# Altium schematic sheet CSAL.SchDoc
size A4; SheetNumber: 1; SheetTotal: 1
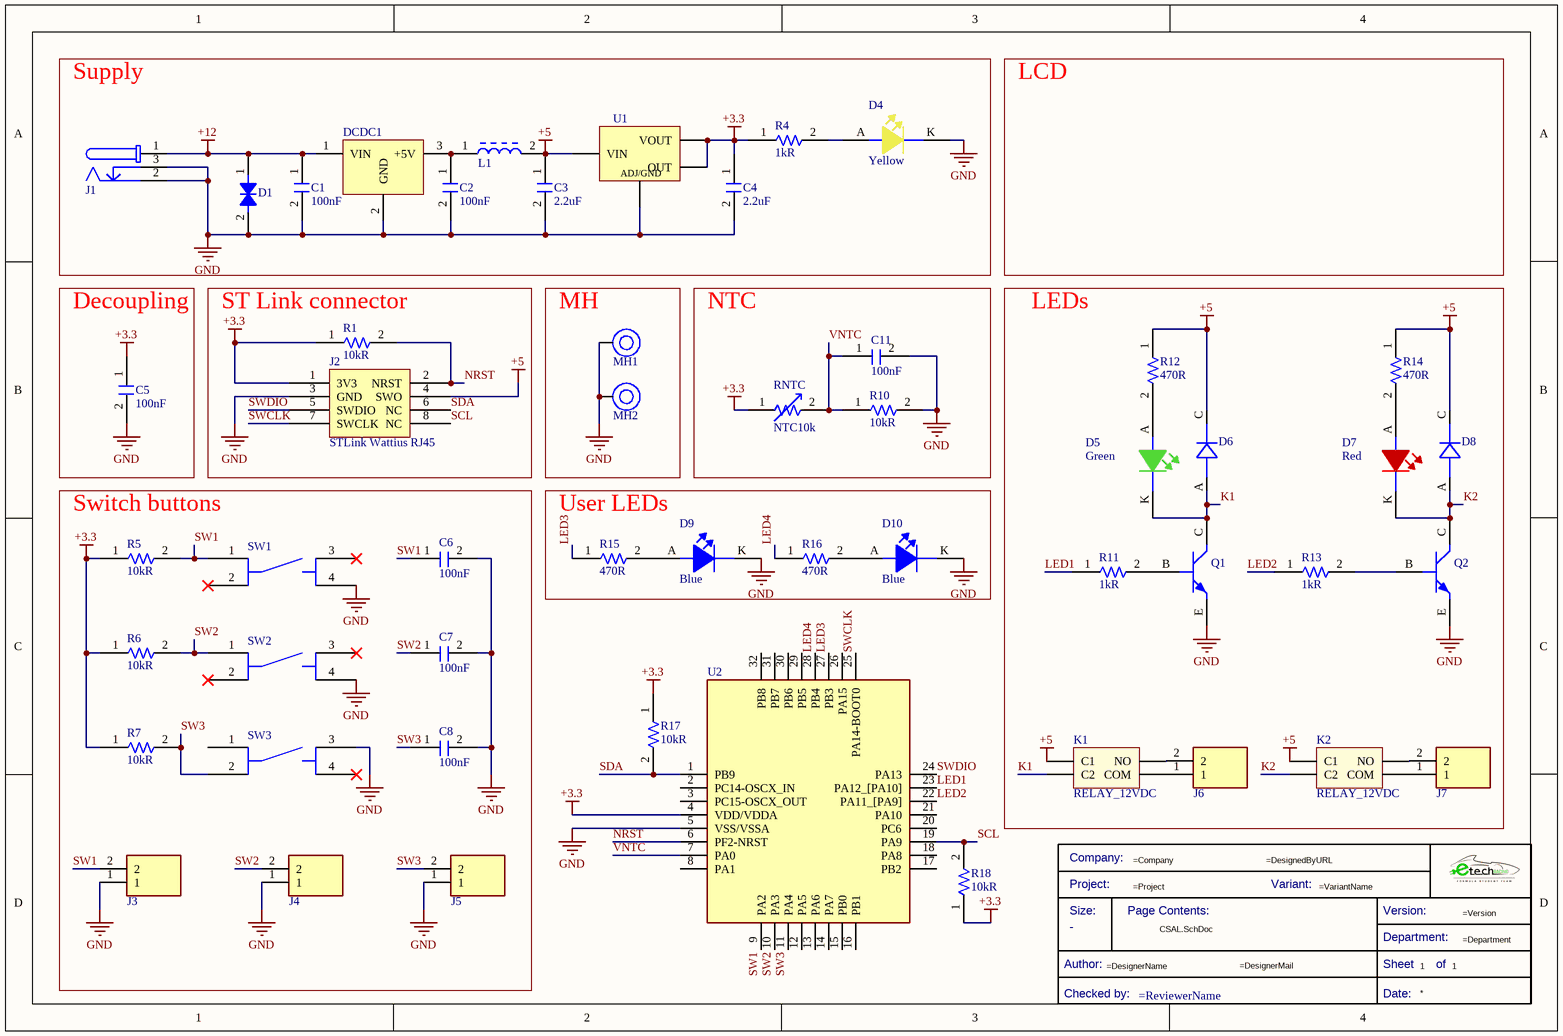
[diagram p0: CSAL.SchDoc]

## Parts
*  Title Block_template  (value not drawn)  (graphical)
C1  Capacitance: 100nF  [C0805FNPC-R]  (hidden comment: 885012207098)
C2  Capacitance: 100nF  [C0805FNPC-R]  (hidden comment: 885012207098)
C3  2.2uF  [C0805FNPC-W]
C4  2.2uF  [C0805FNPC-W]
C5  Capacitance: 100nF  [C0805FNPC-R]  (hidden comment: 885012207098)
C6  Capacitance: 100nF  [C0805FNPC-R]  (hidden comment: 885012207098)
C7  Capacitance: 100nF  [C0805FNPC-R]  (hidden comment: 885012207098)
C8  Capacitance: 100nF  [C0805FNPC-R]  (hidden comment: 885012207098)
C11  Capacitance: 100nF  [C0805FNPC-R]  (hidden comment: 885012207098)
D1  824501261  [DTVS-DO-214AC]  (value not drawn)
D4  Color: Yellow  [LED_1206_WE]  (hidden comment: 150120YS75000)
D5  Color: Green  [LED_1206_WE]  (hidden comment: 150120GS75000)
D6  D_THT_1N4004  [D_THT]  (value not drawn)
D7  Color: Red  [LED_1206_WE]  (hidden comment: 150120RS75000)
D8  D_THT_1N4004  [D_THT]  (value not drawn)
D9  Color: Blue  [LED_1206_WE]  (hidden comment: 150120BS75000)
D10  Color: Blue  [LED_1206_WE]  (hidden comment: 150120BS75000)
DCDC1  173010542  [DCDC_Magi3c]  (value not drawn)
J1  694108301002  [694108301002]  (value not drawn)
J2  STLink Wattius RJ45  [STLINK_RJ45]
J3  J_2_CableContact  [TE_282834-2]  (value not drawn)
J4  J_2_CableContact  [TE_282834-2]  (value not drawn)
J5  J_2_CableContact  [TE_282834-2]  (value not drawn)
J6  J_2_CableContact  [TE_282834-2]  (value not drawn)
J7  J_2_CableContact  [TE_282834-2]  (value not drawn)
K1  RELAY_12VDC  [RELAY_ALQ305]
K2  RELAY_12VDC  [RELAY_ALQ305]
L1  BLM18EG331TN1D  [L_Ferrite_Bead_0805]  (value not drawn)
MH1  Mounting_Hole_M3  [Mounting_Hole_M3]  (value not drawn)
MH2  Mounting_Hole_M3  [Mounting_Hole_M3]  (value not drawn)
Q1  BC817-25LT1G  [TRT-NPN-0.5/45-SOT23]  (value not drawn)
Q2  BC817-25LT1G  [TRT-NPN-0.5/45-SOT23]  (value not drawn)
R1  Resistance: 10kR  [R0805FTK]  (hidden comment: CR0805-JW-103ELF)
R4  Resistance: 1kR  [R0805FTK]  (hidden comment: CR0805-JW-102ELF)
R5  Resistance: 10kR  [R0805FTK]  (hidden comment: CR0805-JW-103ELF)
R6  Resistance: 10kR  [R0805FTK]  (hidden comment: CR0805-JW-103ELF)
R7  Resistance: 10kR  [R0805FTK]  (hidden comment: CR0805-JW-103ELF)
R10  Resistance: 10kR  [R0805FTK]  (hidden comment: CR0805-JW-103ELF)
R11  Resistance: 1kR  [R0805FTK]  (hidden comment: CR0805-JW-102ELF)
R12  Resistance: 470R  [R0805FTK]  (hidden comment: CR0805-FX-4700GLF)
R13  Resistance: 1kR  [R0805FTK]  (hidden comment: CR0805-JW-102ELF)
R14  Resistance: 470R  [R0805FTK]  (hidden comment: CR0805-FX-4700GLF)
R15  Resistance: 470R  [R0805FTK]  (hidden comment: CR0805-FX-4700GLF)
R16  Resistance: 470R  [R0805FTK]  (hidden comment: CR0805-FX-4700GLF)
R17  Resistance: 10kR  [R0805FTK]  (hidden comment: CR0805-JW-103ELF)
R18  Resistance: 10kR  [R0805FTK]  (hidden comment: CR0805-JW-103ELF)
RNTC  NTC10k  [NTC10k_0805]
SW1  Tactile SW  [SW_2-1437565-7]  (value not drawn)
SW2  Tactile SW  [SW_2-1437565-7]  (value not drawn)
SW3  Tactile SW  [SW_2-1437565-7]  (value not drawn)
U1  LM1117IMP-3.3/NOPB  [LDO_10V-0.8/3V3-SOT223]  (value not drawn)
U2  STM32C031K4T6  [QFP80P900X900X160-32N]  (value not drawn)

## Blocks framed on the sheet
Supply: C1-C4 D1 D4 DCDC1 J1 L1 R4 U1
Decoupling: C5
ST Link connector: J2 R1
MH: MH1 MH2
NTC: C11 R10 RNTC
LEDs: D5-D8 J6 J7 K1 K2 Q1 Q2 R11-R14
Switch buttons: C6-C8 J3-J5 R5-R7 SW1-SW3
User LEDs: D9 D10 R15 R16

## Nets
+3.3: C4.1 C5.1 J2.1(3V3) R1.1 R4.1 R5.1 R6.1 R7.1 R17.1 R18.1 RNTC.1 U1.2(OUT) U1.4(VOUT) U2.4(VDD/VDDA)
+5: C3.1 D6.C D8.C J2.4(SWO) K1.C1 K2.C1 L1.2 R12.1 R14.1 U1.3(VIN)
+12: C1.1 D1.1 DCDC1.1(VIN) J1.1
GND: C1.2 C2.2 C3.2 C4.2 C5.2 C6.2 C7.2 C8.2 C11.2 D1.2 D4.K D9.K D10.K DCDC1.2(GND) J1.2 J1.3 J2.3(GND) J3.1 J4.1 J5.1 MH1.1 MH2.1 Q1.E Q2.E R10.2 SW1.4 SW2.4 SW3.3 U1.1(ADJ/GND) U2.5(VSS/VSSA)
K1: D5.K D6.A K1.C2 Q1.C
K2: D7.K D8.A K2.C2 Q2.C
LED1: R11.1 U2.23(PA12_[PA10])
LED2: R13.1 U2.22(PA11_[PA9])
LED3: R15.1 U2.27(PB3)
LED4: R16.1 U2.28(PB4)
NRST: J2.2(NRST) R1.2 U2.6(PF2-NRST)
SCL: J2.8(NC) R18.2 U2.19(PA9)
SDA: J2.6(NC) R17.2 U2.1(PB9)
SW1: C6.1 J3.2 R5.2 SW1.1
SW2: C7.1 J4.2 R6.2 SW2.1
SW3: C8.1 J5.2 R7.2 SW3.2
SWCLK: J2.7(SWCLK) U2.25(PA14-BOOT0)
SWDIO: J2.5(SWDIO) U2.24(PA13)
VNTC: C11.1 R10.1 RNTC.2 U2.7(PA0)
NetC2_1: C2.1 DCDC1.3(+5V) L1.1
NetD4_A: D4.A R4.2
NetD5_A: D5.A R12.2
NetD7_A: D7.A R14.2
NetD9_A: D9.A R15.2
NetD10_A: D10.A R16.2
NetJ6_1: J6.1 K1.COM
NetJ6_2: J6.2 K1.NO
NetJ7_1: J7.1 K2.COM
NetJ7_2: J7.2 K2.NO
NetQ1_B: Q1.B R11.2
NetQ2_B: Q2.B R13.2

Not connected (* = marked no-connect by the designer): SW1 2* 3*; SW2 2* 3*; SW3 1 4*; U2 2(PC14-OSCX_IN) 3(PC15-OSCX_OUT) 8(PA1) 9(PA2) 10(PA3) 11(PA4) 12(PA5) 13(PA6) 14(PA7) 15(PB0) 16(PB1) 17(PB2) 18(PA8) 20(PC6) 21(PA10) 26(PA15) 29(PB5) 30(PB6) 31(PB7) 32(PB8)

## Notes on the sheet
- LCD
- Labels drawn without touching a wire or pin: SW1, SW2, SW3
- (in symbol Title Block_template) Company:; Project:; Variant:; Size:; Page Contents:; Version:; Department:; Author:; Sheet; of; Checked by:; Date:

## Library data of the parts
* = Title Block_template: Standard Title Block; .Creator: GP; Category: Title Block; .PCBcheck: GP; .SCHcheck: GP; Checked by:: =ReviewerName; Size: -
C1 C2 C5-C8 C11 = C100n-50V-0805FNPC-X7R: Cap, 0.1ΜF, 50V, 10%, X7R, 0805; Manufacturer 1: Wurth Electronics; .Creator: DR; Supplier 1: RSComponents; Manufacturer Part Number 1: 885012207098; RoHS: Yes; Category: Ceramic Capacitors; Stock 1: 8000; Pricing 1: 100=0,10200, 500=0,07100, 2000=0,06100 (GBP); Mount: Surface Mount; Case/Package: 0805; Case Code (Metric): 2012; Case Code (Imperial): 0805; Min Operating Temperature: -55°C; Max Operating Temperature: 125°C; Packaging: Cut Tape; Voltage Rating: 50V; Dielectric: X7R; Tolerance: 10%; Voltage Rating (DC): 50V; Length: 0.079inch; Width: 0.049inch; Thickness: 0.035inch; REACH SVHC: Unknown; RoHS Compliant: Yes; ComponentLink1URL: http://www.farnell.com/datasheets/1958498.pdf?src-supplier=Farnell; ComponentLink1Description: http://www.farnell.com/datasheets/1958498.pdf?src-supplier=Farnell; ComponentLink2URL: http://www.farnell.com/datasheets/1958498.pdf?src-supplier=Element14; ComponentLink2Description: http://www.farnell.com/datasheets/1958498.pdf?src-supplier=Element14; ComponentLink3URL: https://katalog.we-online.de/pbs/datasheet/885012207098.pdf?src-supplier=Digi-Key; ComponentLink3Description: https://katalog.we-online.de/pbs/datasheet/885012207098.pdf?src-supplier=Digi-Key; ComponentLink4URL: http://www.farnell.com/datasheets/1958498.pdf?src-supplier=Newark; ComponentLink4Description: http://www.farnell.com/datasheets/1958498.pdf?src-supplier=Newark; Supplier Part Number 1: 1813493
C3 C4 = C2.2u-16V-0805FTK
D1 = DTVS-26V-DO-214AC: TVS diode [Würth Elektronik] 824501261 TVS diode; Manufacturer: Wurth Electronics; Number of Bidirectional Channels: 1; Reverse Standoff Voltage: 26V; Min Breakdown Voltage: 30.4V; Clamping Voltage: 42.1V; Peak Pulse Power: 400W; Power Line Protection: No; Polarity: Bidirectional; Peak Pulse Current: 9.5A; .Creator: DO; Supplier 1: RSComponents; Manufacturer Part Number: 824501261; RoHS: Yes; Category: TVS Diodes; Stock 1: 1; Pricing 1: 50=0,29400, 250=0,26100, 500=0,21200, 1000=0,20100, 2000=0,19600 (USD); Mount: Surface Mount; Number of Pins: 2; Min Operating Temperature: -65°C; Max Operating Temperature: 150°C; Packaging: Cut Tape; Max Breakdown Voltage: 30.4V; Resistor Type: Zener; REACH SVHC: Unknown; RoHS Compliant: Yes; ComponentLink1URL: http://www.farnell.com/datasheets/2036389.pdf?src-supplier=Farnell; ComponentLink1Description: http://www.farnell.com/datasheets/2036389.pdf?src-supplier=Farnell; ComponentLink2URL: http://www.farnell.com/datasheets/2036389.pdf?src-supplier=Element14; ComponentLink2Description: http://www.farnell.com/datasheets/2036389.pdf?src-supplier=Element14; ComponentLink3URL: https://katalog.we-online.de/pbs/datasheet/824501261.pdf?src-supplier=Digi-Key; ComponentLink3Description: https://katalog.we-online.de/pbs/datasheet/824501261.pdf?src-supplier=Digi-Key; Supplier Part Number 1: 9217305; ComponentLink4Description: Where buy it; ComponentLink4URL: https://www.we-online.com/catalog/en/WE-TVSP?sq=824501261#824501261
D4 = LEDYS-1206-120: Led, Yellow, 590 Nm, 2 V, 30 Ma, 120 Mcd Rohs Compliant: Yes; Manufacturer: Wurth Electronics; Wavelength: 590nm; Luminous Intensity: 120mcd; Forward Current: 30mA; Viewing Angle: 140°; Lens Style: Clear,Rectangular; Test Current: 20mA; Forward Voltage: 2V; .Creator: GP; Supplier 1: Newark; Manufacturer Part Number: 150120YS75000; RoHS: Yes; Category: LEDs; Stock 1: 7333; Pricing 1: 1=0,22700, 5=0,22700, 10=0,22100, 25=0,21300, 50=0,20700, 100=0,18200, 500=0,16200 (USD); Mount: Surface Mount; Case/Package: 1206; Case Code (Metric): 3216; Case Code (Imperial): 1206; Min Operating Temperature: -40°C; Max Operating Temperature: 85°C; Package Quantity: 3000; Packaging: Tape and Reel; Dominant Wavelength: 590nm; Length: 3.2mm; Width: 1.6mm; Height: 0.68mm; REACH SVHC: Unknown; RoHS Compliant: Yes; ComponentLink1URL: https://datasheet.ciiva.com/29561/150120ys75000-29561868.pdf?src-supplier=Digi-Key; ComponentLink1Description: https://datasheet.ciiva.com/29561/150120ys75000-29561868.pdf?src-supplier=Digi-Key; ComponentLink2URL: https://datasheet.ciiva.com/29279/759445-da-01-en-chipled-1206-w-kl-gelb-150120ys75000-29279074.pdf?src-supplier=Conrad; ComponentLink2Description: https://datasheet.ciiva.com/29279/759445-da-01-en-chipled-1206-w-kl-gelb-150120ys75000-29279074.pdf?src-supplier=Conrad; Supplier Part Number 1: 95W3811; ComponentLink3Description: Where buy it; ComponentLink3URL: https://www.we-online.com/catalog/en/WL-SMCW?sq=150120YS75000#150120YS75000
D5 = LEDGS-1206-450: Led, Green, 520 Nm, 3.2 V, 30 Ma, 450 Mcd Rohs Compliant: Yes; Manufacturer: Wurth Electronics; Wavelength: 520nm; Luminous Intensity: 450mcd; Viewing Angle: 140°; Forward Current: 30mA; Lens Style: Clear,Rectangular; Test Current: 20mA; Forward Voltage: 3.2V; .Creator: GP; Supplier 1: RSComponents; RoHS: Yes; Category: LEDs; Stock 1: 1; Pricing 1: 50=0,23200, 500=0,16400, 750=0,15500, 1500=0,15000, 3000=0,14200 (USD); Mount: Surface Mount; Case/Package: 1206; Case Code (Metric): 3216; Case Code (Imperial): 1206; Min Operating Temperature: -40°C; Max Operating Temperature: 85°C; Package Quantity: 3000; Packaging: Tape and Reel; Dominant Wavelength: 520nm; Length: 3.2mm; Width: 1.6mm; Height: 0.68mm; REACH SVHC: Unknown; RoHS Compliant: Yes; ComponentLink1URL: https://datasheet.ciiva.com/22656/150120gs75000-22656979.pdf?src-supplier=Element14; ComponentLink1Description: https://datasheet.ciiva.com/22656/150120gs75000-22656979.pdf?src-supplier=Element14; ComponentLink2URL: https://datasheet.ciiva.com/29279/759441-da-01-en-chipled-1206-w-kl-gruen-150120gs75000-29279042.pdf?src-supplier=Conrad; ComponentLink2Description: https://datasheet.ciiva.com/29279/759441-da-01-en-chipled-1206-w-kl-gruen-150120gs75000-29279042.pdf?src-supplier=Conrad; ComponentLink3URL: https://datasheet.ciiva.com/48430/150120gs75000-eng-tds-48430053.pdf?src-supplier=Distrelec; ComponentLink3Description: https://datasheet.ciiva.com/48430/150120gs75000-eng-tds-48430053.pdf?src-supplier=Distrelec; ComponentLink4URL: https://datasheet.ciiva.com/29561/150120gs75000-29561883.pdf?src-supplier=Digi-Key; ComponentLink4Description: https://datasheet.ciiva.com/29561/150120gs75000-29561883.pdf?src-supplier=Digi-Key; ComponentLink5URL: https://datasheet.ciiva.com/29561/150120gs75000-29561884.pdf?src-supplier=Digi-Key; ComponentLink5Description: https://datasheet.ciiva.com/29561/150120gs75000-29561884.pdf?src-supplier=Digi-Key; ComponentLink6URL: https://datasheet.ciiva.com/29561/150120gs75000-29561885.pdf?src-supplier=Digi-Key; ComponentLink6Description: https://datasheet.ciiva.com/29561/150120gs75000-29561885.pdf?src-supplier=Digi-Key; Supplier Part Number 1: 8154247P; Manufacturer Part Number: 150120GS75000; ComponentLink7Description: Where buy it; ComponentLink7URL: https://www.we-online.com/catalog/en/WL-SMCW?sq=150120GS75000#150120GS75000
D6 D8 = D_THT_1N4004: Diode Standard 400V 1A Through Hole DO-41; MP: 1N4004; MF: ON Semiconductor; Value: *; SnapEDA_Link: https://www.snapeda.com/parts/1N4004/ON%20Semiconductor/view-part/2776954/?ref=snap; Check_prices: https://www.snapeda.com/parts/1N4004/ON%20Semiconductor/view-part/2776954/?ref=eda; Availability: Good; Price: None; Package: DO-41 Diodes Inc.
D7 = LEDRS-1206-150: Led, Red, 625 Nm, 2 V, 30 Ma, 150 Mcd Rohs Compliant: Yes; Manufacturer: Wurth Electronics; Viewing Angle: 140°; Lens Style: Clear,Rectangular; Luminous Intensity: 150mcd; Wavelength: 625nm; Forward Current: 30mA; Test Current: 20mA; Forward Voltage: 2V; .Creator: GP; Supplier 1: RSComponents; Manufacturer Part Number: 150120RS75000; RoHS: Yes; Category: LEDs; Stock 1: 1; Pricing 1: 50=0,23200, 500=0,16400, 750=0,15500, 1500=0,15000, 3000=0,14200 (USD); Mount: Surface Mount; Case/Package: 1206; Case Code (Metric): 3216; Case Code (Imperial): 1206; Min Operating Temperature: -40°C; Max Operating Temperature: 85°C; Package Quantity: 1; Packaging: Tape and Reel; Dominant Wavelength: 625nm; Length: 3.2mm; Width: 1.6mm; Height: 0.68mm; REACH SVHC: Unknown; RoHS Compliant: Yes; ComponentLink1URL: https://datasheet.ciiva.com/29561/150120rs75000-29561888.pdf?src-supplier=Digi-Key; ComponentLink1Description: https://datasheet.ciiva.com/29561/150120rs75000-29561888.pdf?src-supplier=Digi-Key; ComponentLink2URL: https://datasheet.ciiva.com/29279/759442-da-01-en-chipled-1206-w-kl-rot-150120rs75000-29279067.pdf?src-supplier=Conrad; ComponentLink2Description: https://datasheet.ciiva.com/29279/759442-da-01-en-chipled-1206-w-kl-rot-150120rs75000-29279067.pdf?src-supplier=Conrad; ComponentLink3URL: https://datasheet.ciiva.com/22656/1911465-22656982.pdf?src-supplier=Element14; ComponentLink3Description: https://datasheet.ciiva.com/22656/1911465-22656982.pdf?src-supplier=Element14; ComponentLink4URL: https://datasheet.ciiva.com/48430/150120rs75000-eng-tds-48430054.pdf?src-supplier=Distrelec; ComponentLink4Description: https://datasheet.ciiva.com/48430/150120rs75000-eng-tds-48430054.pdf?src-supplier=Distrelec; Supplier Part Number 1: 8154256P; ComponentLink5Description: Where buy it; ComponentLink5URL: https://www.we-online.com/catalog/en/WL-SMCW#/articles/WL-SMCW-1206
D9 D10 = LEDBS-1206-145: Led, Blue, 470 Nm, 3.2 V, 30 Ma, 145 Mcd Rohs Compliant: Yes; Manufacturer: Wurth Electronics; Luminous Intensity: 145mcd; Viewing Angle: 140°; Wavelength: 470nm; Forward Current: 30mA; Lens Style: Clear,Rectangular; Test Current: 20mA; Forward Voltage: 3.2V; .Creator: GP; Supplier 1: RSComponents; Manufacturer Part Number: 150120BS75000; RoHS: Yes; Category: LEDs; Stock 1: 1; Pricing 1: 50=0,23200, 500=0,16400, 750=0,15500, 1500=0,15000, 3000=0,14200 (USD); Mount: Surface Mount; Case/Package: 1206; Case Code (Metric): 3216; Case Code (Imperial): 1206; Min Operating Temperature: -40°C; Max Operating Temperature: 85°C; Package Quantity: 3000; Packaging: Tape and Reel; Dominant Wavelength: 470nm; Length: 3.2mm; Width: 1.6mm; Height: 0.68mm; REACH SVHC: Unknown; RoHS Compliant: Yes; ComponentLink1URL: https://datasheet.ciiva.com/22656/150120bs75000-22656976.pdf?src-supplier=Element14; ComponentLink1Description: https://datasheet.ciiva.com/22656/150120bs75000-22656976.pdf?src-supplier=Element14; ComponentLink2URL: https://datasheet.ciiva.com/29279/759440-da-01-en-chipled-1206-w-kl-blau-150120bs75000-29279045.pdf?src-supplier=Conrad; ComponentLink2Description: https://datasheet.ciiva.com/29279/759440-da-01-en-chipled-1206-w-kl-blau-150120bs75000-29279045.pdf?src-supplier=Conrad; ComponentLink3URL: https://datasheet.ciiva.com/29561/150120bs75000-29561882.pdf?src-supplier=Digi-Key; ComponentLink3Description: https://datasheet.ciiva.com/29561/150120bs75000-29561882.pdf?src-supplier=Digi-Key; Supplier Part Number 1: 8154243; ComponentLink4Description: Where buy it; ComponentLink4URL: https://www.we-online.com/catalog/en/WL-SMCW?sq=150120BS75000#150120BS75000
DCDC1 = DCDC-42V/5V-1A: Würth Elektronik 8-42V to 5V 1A DC-DC; Manufacturer 1: Wurth Electronics; Number of Outputs: 1; Min Input Voltage: 8V; Max Input Voltage: 42V; Efficiency: 93%; .Creator: DR; Supplier 1: RSComponents; Manufacturer Part Number 1: 173010542; RoHS: Yes; Stock 1: 1; Pricing 1: 1=12,22500, 8=10,96900, 21=10,68900 (USD); Mount: Through Hole; Min Operating Temperature: -40°C; Max Operating Temperature: 85°C; Features: UVLO,OCP,OTP,SCP; Packaging: Rail/Tube; Voltage - Output 1: 5V; Max Output Current: 1A; RoHS Compliant: Yes; ComponentLink1URL: http://www.farnell.com/datasheets/2192895.pdf?src-supplier=Farnell; ComponentLink1Description: http://www.farnell.com/datasheets/2192895.pdf?src-supplier=Farnell; ComponentLink2URL: http://www.farnell.com/datasheets/2192895.pdf?src-supplier=Newark; ComponentLink2Description: http://www.farnell.com/datasheets/2192895.pdf?src-supplier=Newark; ComponentLink3URL: https://katalog.we-online.de/pm/datasheet/173010542.pdf?src-supplier=Digi-Key; ComponentLink3Description: https://katalog.we-online.de/pm/datasheet/173010542.pdf?src-supplier=Digi-Key; Supplier Part Number 1: 1447809
J1 = Supply_Jack_12V: WR-DC DC Power Jack Connector, Male, Right Angled, 24V, 5A; Manufacturer: Wurth Elektronik; Opening Diameter: 6.4mm; Plug Inner Diameter: 2.55mm; Plug Outer Diameter: 5.5mm; ComponentLink1Description: Website Link; ComponentLink1URL: https://www.we-online.com/redexpert/article/694108301002?ad; ComponentLink2Description: Datasheet Link; ComponentLink2URL: https://www.we-online.com/redexpert/spec/694108301002?ad; Manufacturer Part Number: 694108301002; Category: DC Power Jack Connector; Match Code: WR-DC; Mount: Through Hole; Operating Temperature Max: 85°C; Operating Temperature Min: -40°C; Packaging: Bag; Gender: Male; Orientation: Right Angled; Rated Current: 5A; Working Voltage: 24V
J2 = STLink_Wattius_RJ45_Adapter
J3-J7 = J_2_CableContact: MP: 282834-2; MF: {'manufacturer': u'TE Connectivity'}; Value: *; Availability: Unavailable; Package: None; Price: None
L1 = L_Ferrite_bead_BLM18EG331TN1D: Ferrite Beads Multi-Layer 330Ohm 25% 100MHz 500mA 210mOhm DCR 0603 Paper T/R; Manufacturer: Murata; Material: Ferrite,Steel; Impedance: 330R; DC Resistance (DCR): 210mR; Number of Lines: 1; .Creator: GP; Supplier 1: Digi-Key; Manufacturer Part Number: BLM18EG331TN1D; RoHS: Yes; Category: Ferrite Beads and Chips; Stock 1: 20037; Pricing 1: 1=0,23000, 10=0,17500, 25=0,14520, 50=0,12520, 100=0,11260, 250=0,09508, 500=0,08508, 1000=0,07257 (USD); Case/Package: 0603; Number of Pins: 2; Core Material: Ferrite; Case Code (Metric): 1608; Case Code (Imperial): 0603; Min Operating Temperature: -55°C; Max Operating Temperature: 125°C; Tolerance: 25%; Packaging: Tape and Reel; Current Rating: 500mA; Max DC Current: 500mA; Number of Circuits: 1; Package Quantity: 1; Max Current Rating: 500mA; Termination: SMD/SMT; Test Frequency: 100MHz; Series: BLM18E; Resistance: 210mR; Length: 1.6mm; Width: 0.8mm; Height: 0.8mm; Depth: 0.8mm; REACH SVHC: No SVHC; Lead Free: Lead Free; RoHS Compliant: Yes; ComponentLink1URL: https://datasheet.ciiva.com/1467/5169-1467232.pdf?src-supplier=Element14; ComponentLink1Description: https://datasheet.ciiva.com/1467/5169-1467232.pdf?src-supplier=Element14; ComponentLink2URL: https://datasheet.ciiva.com/11795/0900766b811b5866-11795405.pdf?src-supplier=RSComponents; ComponentLink2Description: https://datasheet.ciiva.com/11795/0900766b811b5866-11795405.pdf?src-supplier=RSComponents; ComponentLink3URL: https://datasheet.ciiva.com/41449/001172267-da-01-en-drossel-0603-330r-1-6x0-8mm-4000st-41449581.pdf?src-supplier=Conrad; ComponentLink3Description: https://datasheet.ciiva.com/41449/001172267-da-01-en-drossel-0603-330r-1-6x0-8mm-4000st-41449581.pdf?src-supplier=Conrad; ComponentLink4URL: https://datasheet.ciiva.com/1467/5169-1467233.pdf?src-supplier=Element14; ComponentLink4Description: https://datasheet.ciiva.com/1467/5169-1467233.pdf?src-supplier=Element14; ComponentLink5URL: https://datasheet.ciiva.com/1561/5169-1561345.pdf?src-supplier=Newark; ComponentLink5Description: https://datasheet.ciiva.com/1561/5169-1561345.pdf?src-supplier=Newark; ComponentLink6URL: https://datasheet.ciiva.com/3082/l0110s0101blm18e-3082714.pdf?src-supplier=Avnet; ComponentLink6Description: https://datasheet.ciiva.com/3082/l0110s0101blm18e-3082714.pdf?src-supplier=Avnet; ComponentLink7URL: https://datasheet.ciiva.com/6211/l0110s0101blm18e-6211470.pdf?src-supplier=Digi-Key; ComponentLink7Description: https://datasheet.ciiva.com/6211/l0110s0101blm18e-6211470.pdf?src-supplier=Digi-Key; ComponentLink8URL: https://datasheet.ciiva.com/6211/l0110s0101blm18e-6211471.pdf?src-supplier=Digi-Key; ComponentLink8Description: https://datasheet.ciiva.com/6211/l0110s0101blm18e-6211471.pdf?src-supplier=Digi-Key; Supplier Part Number 1: 490-5913-1-ND
Q1 Q2 = TRT-NPN-0.5/45-SOT23: ON Semi BC817-25LT1G NPN Bipolar Transistor; 0.5 A; 45 V; 3-Pin SOT-23; Collector Emitter Voltage (VCEO): 45V; Max Collector Current: 500mA; Collector Base Voltage (VCBO): 50V; Power Dissipation: 300mW; hFE Min: 160; Transition Frequency: 100MHz; Emitter Base Voltage (VEBO): 5V; Element Configuration: Single; Collector-emitter Voltage-Max: 700mV; Number of Elements: 1; .Creator: GP; Category: Transistor; ComponentLink1Description: Datasheet; ComponentLink1URL: *; ComponentLink2Description: Where buy it; ComponentLink2URL: *; Package: *; Type: *; Manufacturer: *; Manufacturer part number: *; Supplier: *; Packaging: *; Max operating temperature: *; Min operating temperature: *; Max power dissipation: *; Power rating: *; RoHS: *; Polarity: *; Vce max: *; Ic max: *; Gain: *; Supplier 1: Digi-Key; Pricing 1: 1=0,20000, 10=0,18500, 100=0,10080, 500=0,06204, 1000=0,04229 (USD); Case/Package: SOT-23-3; Number of Pins: 3; Contact Plating: Tin,Matte; Package Quantity: 1; Collector Emitter Breakdown Voltage: 45V; Max Breakdown Voltage: 45V; Max Frequency: 100MHz; Current Rating: 500mA; Series: -; Frequency: 100MHz; Collector Emitter Saturation Voltage: 700mV; Gain Bandwidth Product: 100MHz; Length: 2.9mm; Width: 1.3mm; Height: 0.94mm; Radiation Hardening: No; Lead Free: Lead Free; Halogen Free: Halogen Free; RoHS Compliant: Yes; REACH SVHC: No SVHC; ComponentLink3URL: https://datasheet.ciiva.com/27748/2010413-27748829.pdf?src-supplier=Jameco; ComponentLink3Description: https://datasheet.ciiva.com/27748/2010413-27748829.pdf?src-supplier=Jameco; ComponentLink4URL: https://datasheet.ciiva.com/15138/getdatasheetpartid-38405-15138602.pdf?src-supplier=Verical; ComponentLink4Description: https://datasheet.ciiva.com/15138/getdatasheetpartid-38405-15138602.pdf?src-supplier=Verical; ComponentLink5URL: https://datasheet.ciiva.com/1196/bc817-16lt1-d-1196558.pdf?src-supplier=Element14; ComponentLink5Description: https://datasheet.ciiva.com/1196/bc817-16lt1-d-1196558.pdf?src-supplier=Element14; ComponentLink6URL: https://datasheet.ciiva.com/22641/bc817-16lt1-d-22641013.pdf?src-supplier=Farnell; ComponentLink6Description: https://datasheet.ciiva.com/22641/bc817-16lt1-d-22641013.pdf?src-supplier=Farnell; ComponentLink7URL: https://datasheet.ciiva.com/22664/bc817-16lt1-d-22664204.pdf?src-supplier=Element14; ComponentLink7Description: https://datasheet.ciiva.com/22664/bc817-16lt1-d-22664204.pdf?src-supplier=Element14; ComponentLink8URL: https://datasheet.ciiva.com/22664/1842041-22664101.pdf?src-supplier=Element14; ComponentLink8Description: https://datasheet.ciiva.com/22664/1842041-22664101.pdf?src-supplier=Element14; ComponentLink9URL: https://datasheet.ciiva.com/4722/bc817-16lt1-d-104560-4722229.pdf?src-supplier=Mouser; ComponentLink9Description: https://datasheet.ciiva.com/4722/bc817-16lt1-d-104560-4722229.pdf?src-supplier=Mouser; ComponentLink10URL: https://datasheet.ciiva.com/1195/bc817-16lt1-d-1195763.pdf?src-supplier=Element14; ComponentLink10Description: https://datasheet.ciiva.com/1195/bc817-16lt1-d-1195763.pdf?src-supplier=Element14; ComponentLink11URL: https://datasheet.ciiva.com/1195/bc817-16lt1-d-1195764.pdf?src-supplier=Element14; ComponentLink11Description: https://datasheet.ciiva.com/1195/bc817-16lt1-d-1195764.pdf?src-supplier=Element14; ComponentLink12URL: https://datasheet.ciiva.com/11197/bc817-16lt1-d-11197514.pdf?src-supplier=Avnet; ComponentLink12Description: https://datasheet.ciiva.com/11197/bc817-16lt1-d-11197514.pdf?src-supplier=Avnet; ComponentLink13URL: https://datasheet.ciiva.com/25996/bc817-16lt1-d-25996327.pdf?src-supplier=Avnet+Europe; ComponentLink13Description: https://datasheet.ciiva.com/25996/bc817-16lt1-d-25996327.pdf?src-supplier=Avnet+Europe; ComponentLink14URL: https://datasheet.ciiva.com/976/bc817-16lt1-d-976357.pdf?src-supplier=Digi-Key; ComponentLink14Description: https://datasheet.ciiva.com/976/bc817-16lt1-d-976357.pdf?src-supplier=Digi-Key; ComponentLink15URL: https://datasheet.ciiva.com/976/bc817-16lt1-d-976358.pdf?src-supplier=Digi-Key; ComponentLink15Description: https://datasheet.ciiva.com/976/bc817-16lt1-d-976358.pdf?src-supplier=Digi-Key; ComponentLink16URL: https://datasheet.ciiva.com/976/bc817-16lt1-d-976356.pdf?src-supplier=Digi-Key; ComponentLink16Description: https://datasheet.ciiva.com/976/bc817-16lt1-d-976356.pdf?src-supplier=Digi-Key; Supplier Part Number 1: BC817-25LT1GOSCT-ND
R1 R5-R7 R10 R17 R18 = R10k-0805FTK: BOURNS         CR0805-JW-103ELF            Surface Mount Chip Resistor, Thick Film, CR Series, 10 kohm, 125 mW,  5%, 150 V; Temperature Coefficient: 200ppm/°C; Power Rating: 125mW; Voltage Rating: 150V; Voltage Rating (DC): 100V; .Creator: DR; Supplier 1: Arrow Electronics; Manufacturer 1: Bourns; Manufacturer Part Number 1: CR0805-JW-103ELF; RoHS: Yes; Category: Chip SMD Resistors; Stock 1: 57566; Pricing 1: 1=0,05790, 10=0,01540, 25=0,01340, 100=0,00340 (USD); Mount: Surface Mount; Case/Package: 0805; Number of Pins: 2; Contact Plating: Tin; Case Code (Metric): 2012; Case Code (Imperial): 0805; Min Operating Temperature: -55°C; Max Operating Temperature: 155°C; Tolerance: 5%; Resistor Type: Thick Film; Package Quantity: 1; Packaging: Tape and Reel; Number of Terminations: 2; Termination: SMD/SMT; Max Power Dissipation: 125mW; Features: Moisture Resistant; Series: CR0805; Construction: Rectangular; Resistance Tolerance: 5%; Technology: THICK FILM; Length: 2mm; Width: 1.25mm; Height: 0.5mm; Depth: 1.25mm; Thickness: 508um; Radiation Hardening: No; REACH SVHC: No SVHC; Military Standard: Not; RoHS Compliant: Yes; ComponentLink1URL: https://datasheet.ciiva.com/11821/0900766b80fcdb72-11821135.pdf?src-supplier=RSComponents; ComponentLink1Description: https://datasheet.ciiva.com/11821/0900766b80fcdb72-11821135.pdf?src-supplier=RSComponents; ComponentLink2URL: https://datasheet.ciiva.com/9122/chpreztr-9122374.pdf?src-supplier=Avnet; ComponentLink2Description: https://datasheet.ciiva.com/9122/chpreztr-9122374.pdf?src-supplier=Avnet; ComponentLink3URL: https://datasheet.ciiva.com/22693/1902866-22693254.pdf?src-supplier=Element14; ComponentLink3Description: https://datasheet.ciiva.com/22693/1902866-22693254.pdf?src-supplier=Element14; ComponentLink4URL: https://datasheet.ciiva.com/7986/691949-7986187.pdf?src-supplier=Element14; ComponentLink4Description: https://datasheet.ciiva.com/7986/691949-7986187.pdf?src-supplier=Element14; ComponentLink5URL: https://datasheet.ciiva.com/30065/159chpreztr-30065976.pdf?src-supplier=Onlinecomponents.com; ComponentLink5Description: https://datasheet.ciiva.com/30065/159chpreztr-30065976.pdf?src-supplier=Onlinecomponents.com; ComponentLink6URL: https://datasheet.ciiva.com/16783/70154685-16783482.pdf?src-supplier=Allied+Electronics; ComponentLink6Description: https://datasheet.ciiva.com/16783/70154685-16783482.pdf?src-supplier=Allied+Electronics; ComponentLink7URL: https://datasheet.ciiva.com/5548/chpreztr-5548491.pdf?src-supplier=Mouser; ComponentLink7Description: https://datasheet.ciiva.com/5548/chpreztr-5548491.pdf?src-supplier=Mouser; ComponentLink8URL: https://datasheet.ciiva.com/6559/chpreztr-6559900.pdf?src-supplier=Digi-Key; ComponentLink8Description: https://datasheet.ciiva.com/6559/chpreztr-6559900.pdf?src-supplier=Digi-Key; ComponentLink9URL: https://datasheet.ciiva.com/6559/chpreztr-6559901.pdf?src-supplier=Digi-Key; ComponentLink9Description: https://datasheet.ciiva.com/6559/chpreztr-6559901.pdf?src-supplier=Digi-Key; ComponentLink10URL: https://datasheet.ciiva.com/7985/1856384-7985869.pdf?src-supplier=Element14; ComponentLink10Description: https://datasheet.ciiva.com/7985/1856384-7985869.pdf?src-supplier=Element14; ComponentLink11URL: https://datasheet.ciiva.com/48692/001055517-da-01-en-smd-wid-cr0805-jw-103elf-10k-ohm-1-8w-48692118.pdf?src-supplier=Conrad; ComponentLink11Description: https://datasheet.ciiva.com/48692/001055517-da-01-en-smd-wid-cr0805-jw-103elf-10k-ohm-1-8w-48692118.pdf?src-supplier=Conrad; Supplier Part Number 1: CR0805-JW-103ELF
R4 R11 R13 = R1k-0805FTK: Res Thick Film 0805 1K Ohm 5% 1/8W ±200ppm/°C Molded SMD SMD Paper Tape on Plastic Reel; Manufacturer 1: Bourns; Voltage Rating (DC): 150V; Power Rating: 125mW; .Creator: GP; Supplier 1: Arrow Electronics; Manufacturer Part Number 1: CR0805-JW-102ELF; RoHS: Yes; Category: Chip SMD Resistors; Stock 1: 27510; Pricing 1: 1=0,05930, 10=0,03510, 25=0,01790, 100=0,00800, 250=0,00790, 500=0,00590, 1000=0,00360, 3000=0,00350, 6000=0,00250 (USD); Mount: Surface Mount; Case/Package: 0805; Number of Pins: 2; Contact Plating: Tin; Case Code (Metric): 2012; Case Code (Imperial): 0805; Min Operating Temperature: -55°C; Max Operating Temperature: 155°C; Resistor Type: Thick Film; Tolerance: 5%; Temperature Coefficient: 200ppm/°C; Features: Moisture Resistant; Package Quantity: 1; Packaging: Tape and Reel; Voltage Rating: 150V; Number of Terminations: 2; Termination: SMD/SMT; Max Power Dissipation: 125mW; Length: 2mm; Width: 1.25mm; Height: 0.5mm; Thickness: 508um; Depth: 1.25mm; Radiation Hardening: No; Lead Free: Lead Free; REACH SVHC: No SVHC; Military Standard: Not; ComponentLink1URL: https://datasheet.ciiva.com/11821/0900766b80fcdb72-11821134.pdf?src-supplier=RSComponents; ComponentLink1Description: https://datasheet.ciiva.com/11821/0900766b80fcdb72-11821134.pdf?src-supplier=RSComponents; ComponentLink2URL: https://datasheet.ciiva.com/15225/getdatasheetpartid-78155-15225381.pdf?src-supplier=Verical; ComponentLink2Description: https://datasheet.ciiva.com/15225/getdatasheetpartid-78155-15225381.pdf?src-supplier=Verical; ComponentLink3URL: https://datasheet.ciiva.com/22693/1902866-22693253.pdf?src-supplier=Element14; ComponentLink3Description: https://datasheet.ciiva.com/22693/1902866-22693253.pdf?src-supplier=Element14; ComponentLink4URL: https://datasheet.ciiva.com/7986/1856384-7986184.pdf?src-supplier=Element14; ComponentLink4Description: https://datasheet.ciiva.com/7986/1856384-7986184.pdf?src-supplier=Element14; ComponentLink5URL: https://datasheet.ciiva.com/7985/1856384-7985867.pdf?src-supplier=Element14; ComponentLink5Description: https://datasheet.ciiva.com/7985/1856384-7985867.pdf?src-supplier=Element14; ComponentLink6URL: https://datasheet.ciiva.com/30242/159chpreztr-30242765.pdf?src-supplier=Onlinecomponents.com; ComponentLink6Description: https://datasheet.ciiva.com/30242/159chpreztr-30242765.pdf?src-supplier=Onlinecomponents.com; ComponentLink7URL: https://datasheet.ciiva.com/6547/chpreztr-6547359.pdf?src-supplier=Digi-Key; ComponentLink7Description: https://datasheet.ciiva.com/6547/chpreztr-6547359.pdf?src-supplier=Digi-Key; Supplier Part Number 1: CR0805-JW-102ELF
R12 R14-R16 = R470-0805FTK: Res Thick Film 0805 470 Ohm 1% 1/8W ±100ppm/°C Molded SMD SMD Paper Tape on Plastic Reel; Manufacturer 1: Bourns; Power Rating: 125mW; Voltage Rating: 150V; .Creator: DR; Supplier 1: Arrow Electronics; Manufacturer Part Number 1: CR0805-FX-4700GLF; RoHS: Yes; Category: Chip SMD Resistors; Stock 1: 12623; Pricing 1: 1=0,00990, 10=0,00980, 25=0,00950, 50=0,00940, 100=0,00930, 250=0,00920, 500=0,00910, 1000=0,00890, 3000=0,00870, 6000=0,00860 (USD); Mount: Surface Mount; Case/Package: 0805; Number of Pins: 2; Case Code (Imperial): 0805; Case Code (Metric): 2012; Contact Plating: Tin; Min Operating Temperature: -55°C; Max Operating Temperature: 155°C; Packaging: Tape and Reel; Tolerance: 1%; Resistor Type: Thick Film; Termination: SMD/SMT; Temperature Coefficient: 100ppm/°C; Voltage Rating (DC): 150V; Features: Moisture Resistant; Series: CR0805; Max Power Dissipation: 125mW; Number of Terminations: 2; Resistance Tolerance: 1%; Construction: Rectangular; Technology: THICK FILM; Length: 2mm; Height: 0.5mm; Depth: 1.25mm; Thickness: 508um; Radiation Hardening: No; REACH SVHC: No SVHC; Military Standard: Not; ComponentLink1URL: https://datasheet.ciiva.com/11808/0900766b80fcdb72-11808686.pdf?src-supplier=RSComponents; ComponentLink1Description: https://datasheet.ciiva.com/11808/0900766b80fcdb72-11808686.pdf?src-supplier=RSComponents; ComponentLink2URL: https://datasheet.ciiva.com/7985/1856384-7985880.pdf?src-supplier=Element14; ComponentLink2Description: https://datasheet.ciiva.com/7985/1856384-7985880.pdf?src-supplier=Element14; ComponentLink3URL: https://datasheet.ciiva.com/22693/1902866-22693247.pdf?src-supplier=Element14; ComponentLink3Description: https://datasheet.ciiva.com/22693/1902866-22693247.pdf?src-supplier=Element14; ComponentLink4URL: https://datasheet.ciiva.com/5541/chpreztr-5541930.pdf?src-supplier=Mouser; ComponentLink4Description: https://datasheet.ciiva.com/5541/chpreztr-5541930.pdf?src-supplier=Mouser; Supplier Part Number 1: CR0805-FX-4700GLF
RNTC = NTC_10k_0805
SW1-SW3 = SW_6x6
U1 = LDO_10V-0.8/3V3-SOT223: LDO Regulator Pos 3.3V 0.8A 4-Pin(3+Tab) SOT-223 T/R / IC REG LDO 3.3V 0.8A SOT223; Manufacturer: Texas Instruments; Number of Outputs: 1; Max Input Voltage: 15V; Max Output Current: 800mA; Polarity: Positive; Quiescent Current: 15mA; Accuracy: 1%; Output Type: Fixed; Dropout Voltage: 1.2V; Min Input Voltage: 2.6V; Max Supply Voltage: 10V; Min Supply Voltage: 4.75V; Current Rating: 800A; .Creator: GP; ComponentLink1URL: https://www.ti.com/lit/ds/symlink/lm1117.pdf?HQS=dis-mous-null-mousermode-dsf-pf-null-wwe&DCM=yes&ref_url=https%3A%2F%2Fwww.mouser.de%2F&distId=26; ComponentLink1Description: Datasheet; ComponentLink2Description: Where buy it; ComponentLink2URL: https://www.mouser.es/ProductDetail/Texas-Instruments/LM1117IMP-33-NOPB?qs=X1J7HmVL2ZFbpN1TgOsjYQ%3D%3D; Supplier 1: Digi-Key; Manufacturer Part Number: LM1117IMP-3.3/NOPB; RoHS: Yes; Category: LDO; Pricing 1: 1=1,41000, 10=1,26300, 25=1,19920, 100=0,98500, 250=0,92072, 500=0,81366 (USD); Mount: Surface Mount; Case/Package: SOT-223; Number of Pins: 4; Min Operating Temperature: -40°C; Max Operating Temperature: 125°C; Output Voltage: 3.3V; Packaging: Tape and Reel; Output Current: 800mA; Nominal Output Voltage: 3.3V; Termination: SMD/SMT; Output Voltage Accuracy: 1%; Number of Regulators: 1; Min Current Limit: 800mA; Package Quantity: 1000; Length: 6.5mm; Width: 3.56mm; Height: 1.6mm; Radiation Hardening: No; REACH SVHC: No SVHC; Lead Free: Lead Free; RoHS Compliant: Yes; ComponentLink3URL: https://datasheet.ciiva.com/27051/1281318-27051810.pdf?src-supplier=Jameco; ComponentLink3Description: https://datasheet.ciiva.com/27051/1281318-27051810.pdf?src-supplier=Jameco; ComponentLink4URL: https://datasheet.ciiva.com/8042/1670636-8042261.pdf?src-supplier=Element14; ComponentLink4Description: https://datasheet.ciiva.com/8042/1670636-8042261.pdf?src-supplier=Element14; ComponentLink5URL: https://datasheet.ciiva.com/1570/1849796-1570171.pdf?src-supplier=Farnell; ComponentLink5Description: https://datasheet.ciiva.com/1570/1849796-1570171.pdf?src-supplier=Farnell; ComponentLink6URL: https://datasheet.ciiva.com/14149/lm1117-eng-tds-14149980.pdf?src-supplier=Distrelec; ComponentLink6Description: https://datasheet.ciiva.com/14149/lm1117-eng-tds-14149980.pdf?src-supplier=Distrelec; ComponentLink7URL: https://datasheet.ciiva.com/46386/1882372-46386042.pdf?src-supplier=Element14; ComponentLink7Description: https://datasheet.ciiva.com/46386/1882372-46386042.pdf?src-supplier=Element14; ComponentLink8URL: https://datasheet.ciiva.com/3223/lm1117-n-3223515.pdf?src-supplier=Avnet; ComponentLink8Description: https://datasheet.ciiva.com/3223/lm1117-n-3223515.pdf?src-supplier=Avnet; ComponentLink9URL: https://datasheet.ciiva.com/6580/lm1117-n-6580030.pdf?src-supplier=Digi-Key; ComponentLink9Description: https://datasheet.ciiva.com/6580/lm1117-n-6580030.pdf?src-supplier=Digi-Key; ComponentLink10URL: https://datasheet.ciiva.com/6580/lm1117-n-6580026.pdf?src-supplier=Digi-Key; ComponentLink10Description: https://datasheet.ciiva.com/6580/lm1117-n-6580026.pdf?src-supplier=Digi-Key; Supplier Part Number 1: LM1117IMP-3.3/NOPBCT-ND
U2 = STM32C031K4T6: Mainstream Arm Cortex-M0+ MCU with 16 Kbytes of Flash memory, 12 Kbytes RAM, 48 MHz CPU, 2x USART, timers, ADC, comm. I/F, 2-3.6V; Manufacturer_Name: STMicroelectronics; Geometry.Height: 1.6mm; Mouser Part Number: 511-STM32C031K4T6; Mouser Price/Stock: https://www.mouser.co.uk/ProductDetail/STMicroelectronics/STM32C031K4T6?qs=IPgv5n7u5QbiXsG7yxbPWw%3D%3D; Manufacturer_Part_Number: STM32C031K4T6; Datasheet Link: https://www.st.com/resource/en/datasheet/stm32c031c4.pdf